# Altium schematic sheet TheremineB.SchDoc
size A4
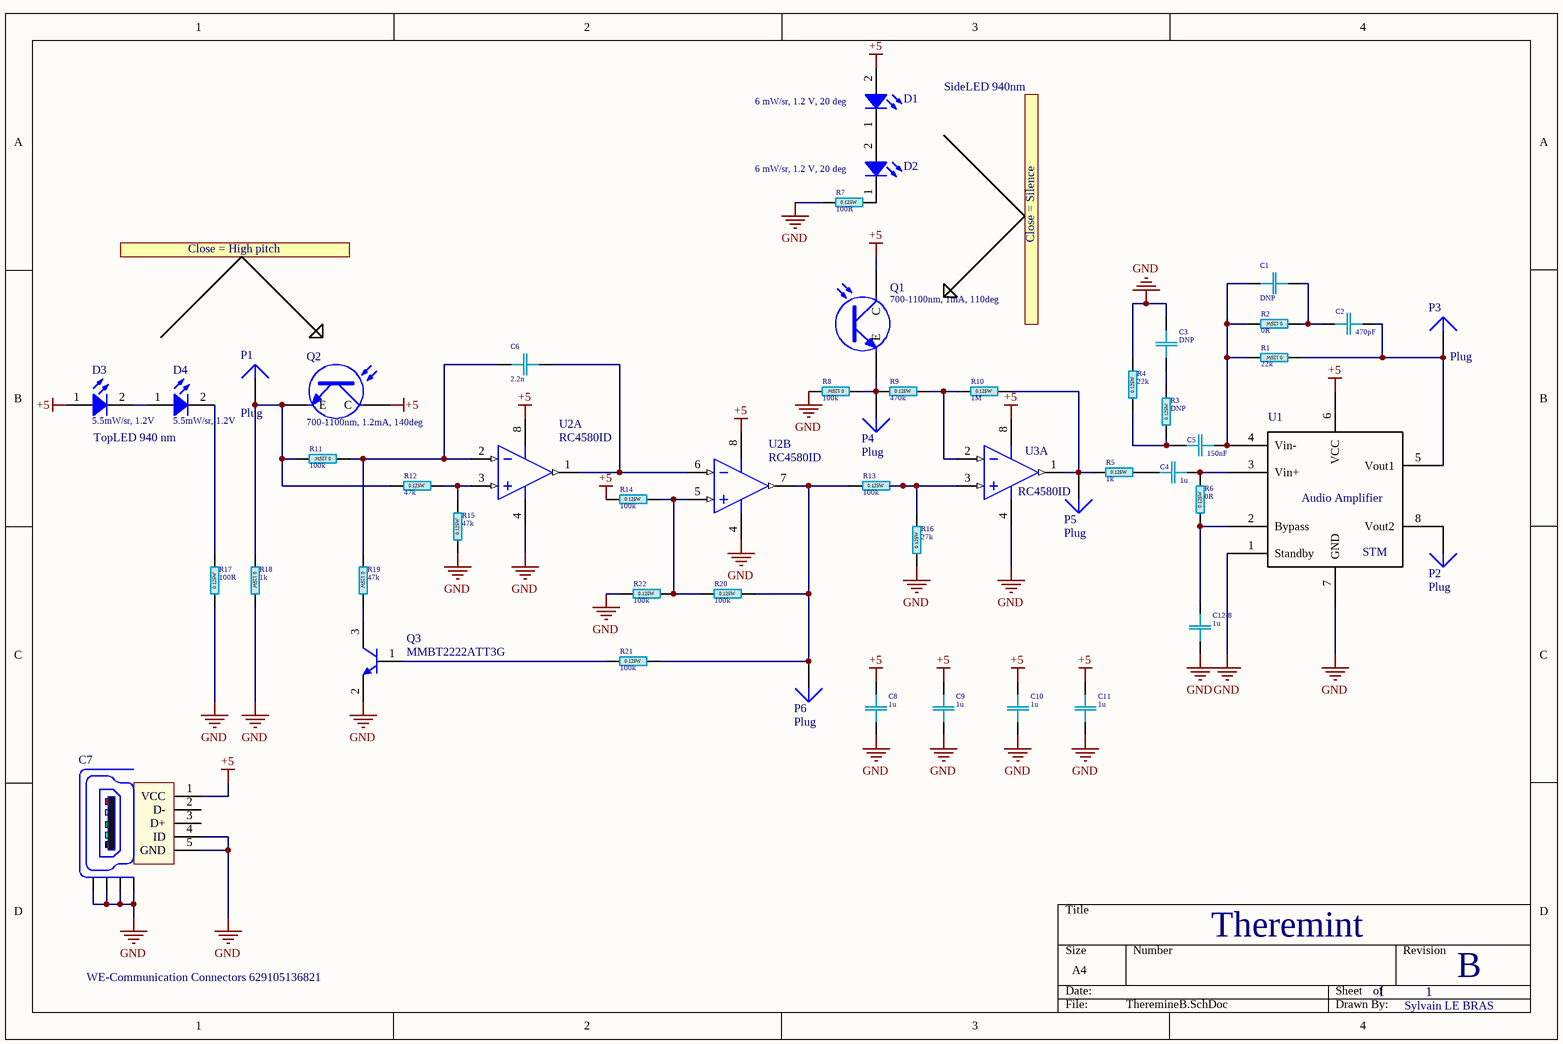
[diagram p0: TheremineB.SchDoc]

## Parts
C1  DNP  [C 0805(2012)x1.25]
C2  470pF  [C 0805(2012)x1.25]
C3  DNP  [C 0805(2012)x1.25]
C4  1u  [C 0805(2012)x1.25]
C5  150nF  [C 0805(2012)x1.25]
C6  2.2n  [C 0805(2012)x0.65]
C7  WE-Communication Connectors 629105136821  [629105136821]
C8  1u  [C 0805(2012)x1.25]
C9  1u  [C 0805(2012)x1.25]
C10  1u  [C 0805(2012)x1.25]
C11  1u  [C 0805(2012)x1.25]
C12-8  1u  [C 0805(2012)x1.25]
D1  6 mW/sr, 1.2 V, 20 deg  [WL-SISW_1206]
D2  6 mW/sr, 1.2 V, 20 deg  [WL-SISW_1206]
D3  5.5mW/sr, 1.2V  [WL-SICW_1206_H=1.21mm]
D4  5.5mW/sr, 1.2V  [WL-SICW_1206_H=1.21mm]
P1  Plug  [PIN1]
P2  Plug  [PIN1]
P3  Plug  [PIN1]
P4  Plug  [PIN1]
P5  Plug  [PIN1]
P6  Plug  [PIN1]
Q1  700-1100nm, 1mA, 110deg  [WL-STSB_1002]
Q2  700-1100nm, 1.2mA, 140deg  [WL-STCB_1206]
Q3  MMBT2222ATT3G  [ON SEMICONDUCTOR SC-75]
R1  22k  [R 0805(2012)]
R2  0R  [R 0805(2012)]
R3  DNP  [R 0805(2012)]
R4  22k  [R 0805(2012)]
R5  1k  [R 0805(2012)]
R6  0R  [R 0805(2012)]
R7  100R  [R 0805(2012)]
R8  100k  [R 0805(2012)]
R9  470k  [R 0805(2012)]
R10  1M  [R 0805(2012)]
R11  100k  [R 0805(2012)]
R12  47k  [R 0805(2012)]
R13  100k  [R 0805(2012)]
R14  100k  [R 0805(2012)]
R15  47k  [R 0805(2012)]
R16  27k  [R 0805(2012)]
R17  100R  [R 0805(2012)]
R18  1k  [R 0805(2012)]
R19  47k  [R 0805(2012)]
R20  100k  [R 0805(2012)]
R21  100k  [R 0805(2012)]
R22  100k  [R 0805(2012)]
U1  STM  [SO8_M]
U2  RC4580ID  [TI-D8_N]  (parts A,B of 2)
U3  RC4580ID  [TI-D8_N]  (part A of 2)

## Nets
+5: C7.1(VCC) C8.2 C9.2 C10.2 C11.2 D1.2(A) D3.1(A) Q1.1(C) Q2.1(C) R14.1 U1.6(VCC) U2.8(VCC+) U3.8(VCC+)
GND: C3.2 C7.4(ID) C7.5(GND) C7.Z1(Shield) C7.Z2(Shield) C7.Z3(Shield) C7.Z4(Shield) C8.1 C9.1 C10.1 C11.1 C12-8.2 Q3.2(E) R4.2 R7.1 R8.2 R15.1 R16.1 R17.1 R18.2 R22.1 U1.1(Standby) U1.7(GND) U2.4(VCC-) U3.4(VCC-)
NetC1_1: C1.1 C5.2 R1.2 R2.2 U1.4(Vin-)
NetC1_2: C1.2 C2.1 R2.1
NetC2_2: C2.2 P3.1 R1.1 U1.5(Vout1)
NetC3_1: C3.1 R3.2
NetC4_1: C4.1 R5.2
NetC4_2: C4.2 R6.2 U1.3(Vin+)
NetC5_1: C5.1 R3.1 R4.1
NetC6_1: C6.1 R11.1 R19.1 U2.2(IN1-)
NetC6_2: C6.2 U2.1(OUT1) U2.6(IN2-)
NetC12-8_1: C12-8.1 R6.1 U1.2(Bypass)
NetD1_1: D1.1(K) D2.2(A)
NetD2_1: D2.1(K) R7.2
NetD3_2: D3.2(K) D4.1(A)
NetD4_2: D4.2(K) R17.2
NetP1_1: P1.1 Q2.2(E) R11.2 R12.1 R18.1
NetP2_1: P2.1 U1.8(Vout2)
NetP4_1: P4.1 Q1.2(E) R8.1 R9.1
NetP5_1: P5.1 R5.1 R10.2 U3.1(OUT1)
NetP6_1: P6.1 R13.1 R20.2 R21.2 U2.7(OUT2)
NetQ3_1: Q3.1(B) R21.1
NetQ3_3: Q3.3(C) R19.2
NetR9_2: R9.2 R10.1 U3.2(IN1-)
NetR12_2: R12.2 R15.2 U2.3(IN1+)
NetR13_2: R13.2 R16.2 U3.3(IN1+)
NetR14_2: R14.2 R20.1 R22.2 U2.5(IN2+)

Not connected (* = marked no-connect by the designer): C7 2(D-) 3(D+)

## Notes on the sheet
- SideLED 940nm
- Close = High pitch
- Close = Silence
- TopLED 940 nm
- Theremint
- 1
- B
- Sylvain LE BRAS

## Library data of the parts
C1-C5 C8-C11 C12-8 = C 0805    16V X7R - 1u: SMD 0805     16V X7R 10%; Part Number: CL21B105KBFNNNF; Manufacturer: Samsung; TYPE: Capacitors; Package-mm: 2012; Mount Type: SMT; Publisher: Hefest; Manufacturer Alternate: *; Part Number Alternate: *; Supplier 1: Comet; Supplier Part Number 1: C0805 1.0uF 50V X7R SAMSUNG; RoHS: Y; Technology: Ceramic  MLCC; Package: 0805; VDC: 16V; TempCo: X7R; Tolerance %: ±10%; VAC: *; ESR Ohm: *; ComponentLink1Description: Datasheet Link; ComponentLink1URL: https://store.comet.bg/download-file.php?id=11; Temperature Range: -55°C ~ +125°C; Price: 0.120; Published: 07.04.2019
  C1 C3: Value: DNP
  C2: Value: 470pF
  C4 C8-C11 C12-8: Value: 1u
  C5: Value: 150nF
C6 = C 0805    50V X7R - 2.2n: SMD 0805     50V X7R 10%; Part Number: CL21B222KBNC; Manufacturer: Samsung; TYPE: Capacitors; Package-mm: 2012; Mount Type: SMT; Publisher: Hefest; Manufacturer Alternate: *; Part Number Alternate: *; Published: 07.04.2019; Supplier 1: Comet; Supplier Part Number 1: C0805 2.2nF 50V X7R SAMSUNG; RoHS: Y; Technology: Ceramic  MLCC; Package: 0805; VDC: 50V; TempCo: X7R; Tolerance %: ±10%; VAC: *; ESR Ohm: *; ComponentLink1Description: Datasheet Link; ComponentLink1URL: https://store.comet.bg/download-file.php?id=11; Temperature Range: -55°C ~ +125°C; Price: 0.026; Value: 2.2n
C7 = WE-Communication Connectors 629105136821: WR-COM Micro USB SMT Type B; Manufacturer: Würth Elektronik eiSos GmbH; ComponentLink1 Description: Manufacturer; ComponentLink2 Description: Datasheet; NoPins: 5; ComponentLink1URL: http://www.we-online.de; ComponentLink2URL: http://katalog.we-online.de/em/datasheet/629105136821.pdf; Created by: Karrer Zheng; Created Date: 10/10/2014; partNo: 629105136821
D1 D2 = 15412094A2070: SMT Infrared Sideview LED Waterclear WL-SISW, size 1206, 6 mW/sr, 1.2 V, 20 deg; Forward Voltage: 1.2 V; Viewing Angle: 20 deg; Peak Wavelength: 940 nm; Radiant Intensity: 6 mW/sr; Chip Technology: AlGaAs; ComponentLink1Description: Manufacturer; ComponentLink1URL: http://www.we-online.de; ComponentLink2Description: Datasheet; ComponentLink2URL: https://katalog.we-online.de/led/datasheet/15412094A2070.pdf; Part Number: 15412094A2070; Published Date: November 2018; Publisher: Wurth Elektronik; Size: 1206; Operating Temperature: -40 to 85 degC; Centroid Wavelength: 940 nm; Emitting Color: Infrared; Mounting Technology: SMT; Packaging: Tape and Reel
D3 D4 = 15412094A9000: WL-SICW SMT Chip LED Infrared Waterclear, size 1206, 5.5mW/sr, 1.2V, 90deg; Chip Technology: AlGaAs; Forward Voltage max.: 1.5V; Centroid Wavelength typ.: 940nm; Radiant Intensity min.: 4mW/sr; Radiant Intensity typ.: 5.5mW/sr; ComponentLink1Description: Manufacturer; ComponentLink1URL: http://www.we-online.de; ComponentLink2URL: https://www.we-online.com/catalog/datasheet/15412094A9000.pdf; ComponentLink2Description: Datasheet; Emitting Color: Infrared; Forward Voltage typ.: 1.2V; Mounting Technology: SMT; Operating Temperature: -40 to +85degC; Published Date: December 2019; Part Number: 15412094A9000; Packaging: Tape and Reel; Peak Wavelength typ.: 940nm; Publisher: Wurth Elektronik; Viewing Angle: 90deg; Size: 1206
Q1 = 1541021NCA170: WL-STSB SMT Phototransistor Chip Black, size 1002, 700-1100nm, 1mA, 110deg; Collector-Emitter Dark Current max.: 100nA; Chip Technology: Si; Range of Spectral Bandwidth max.: 1100nm; Range of Spectral Bandwidth min.: 700nm; Wavelength of Peak Sensitivity typ.: 940nm; Collector Current min.: 0.5mA; ComponentLink1Description: Manufacturer; ComponentLink1URL: http://www.we-online.de; ComponentLink2Description: Datasheet; ComponentLink2URL: https://www.we-online.com/catalog/datasheet/1541021NCA170.pdf; Packaging: Tape and Reel; Published Date: March 2020; Publisher: Wurth Elektronik; Size: 1002; Mounting Technology: SMT; Manufacturer Part Number: 1541021NCA170; Operating Temperature: -40 to +85degC; Viewing Angle: 110deg; Collector Current typ.: 1mA
Q2 = 1541201NEA400: WL-STCB SMT Phototransistor Chip Black, size 1206, 700-1100nm, 1.2mA, 140deg; Collector-Emitter Dark Current max.: 100nA; Chip Technology: Si; Range of Spectral Bandwidth max.: 1100nm; Range of Spectral Bandwidth min.: 700nm; Wavelength of Peak Sensitivity typ.: 940nm; Collector Current min.: 0.1mA; ComponentLink1Description: Manufacturer; ComponentLink1URL: http://www.we-online.de; ComponentLink2Description: Datasheet; ComponentLink2URL: https://www.we-online.com/catalog/datasheet/1541201NEA400.pdf; Packaging: Tape and Reel; Published Date: March 2020; Publisher: Wurth Elektronik; Size: 1206; Mounting Technology: SMT; Manufacturer Part Number: 1541201NEA400; Operating Temperature: -40 to +85degC; Viewing Angle: 140deg; Collector Current typ.: 1.2mA
Q3 = MMBT2222ATT3G: TRANS NPN 40V 0.6A SC75-3; Manufacturer: ON Semiconductor; Current - Collector Cutoff (Max): 10nA (ICBO); Current - Collector (Ic) (Max): 600mA; DC Current Gain (hFE) (Min) @ Ic, Vce: 100 @ 150mA, 10V; Frequency - Transition: 300MHz; Power - Max: 150mW; Vce Saturation (Max) @ Ib, Ic: 1V @ 50mA, 500mA; Part Number: MMBT2222ATT3G; ComponentLink1Description: Datasheet; ComponentLink1URL: //media.digikey.com/pdf/Data%20Sheets/ON%20Semiconductor%20PDFs/MMBT2222LT1-D.pdf; ComponentLink2Description: DigiKey Link; ComponentLink2URL: http://digikey.com/product-detail/en/on-semiconductor/MMBT2222ATT3G/MMBT2222ATT3GOSCT-ND/9086854; LastUpdated: 13/08/2020 11:04:21; Lifecycle Status: Active; Minimum Order: 1; Mounting Type: Surface Mount; Operating Temperature: -55°C ~ 150°C (TJ); Package / Case: SC-75, SOT-416; Packaging: TapeAndReel; PartId: 35; Part Status: Active; Price: 0.03; Series: -; Supplier 1: DigiKey; Supplier Part Number 1: MMBT2222ATT3GOSCT-ND; Supplier Device Package: SC-75, SOT-416; Transistor Type: NPN; Voltage - Collector Emitter Breakdown (Max): 40V
R1-R22 = R 0805-5%: SMD 0805 0.125W 5% 150V; Manufacturer: YAGEO; TempCo: ±100ppm/°C; Package-mm: 2012; Value Code: 102; Part Number: *; Mount Type: SMT; Publisher: Hefest; Manufacturer Alternate: *; Published: 07.04.2019; Supplier 1: Comet; Supplier Part Number 1: R0805 1.0K 5% YAG; RoHS: Y; Technology: Thick film; Package: 0805; VDC: 150V; Tolerance %: ±5%; ComponentLink1Description: Datasheet Link; ComponentLink1URL: https://store.comet.bg/download-file.php?id=140; Temperature Range: -55°C ~ +155°C; Price: 0.029; Part Number Alternate: *; TYPE: Resistor; Power: 0.125W
  R1 R4: Value: 22k
  R2 R6: Value: 0R
  R3: Value: DNP
  R5 R18: Value: 1k
  R7 R17: Value: 100R
  R8 R11 R13 R14 R20-R22: Value: 100k
  R9: Value: 470k
  R10: Value: 1M
  R12 R15 R19: Value: 47k
  R16: Value: 27k
U1 = TS4871: Audio Amplifier
U2 U3 = RC4580ID: Dual Audio Operational Amplifier, 4 to 32 V, -40 to 85 degC, 8-pin SOIC (D8), Green (RoHS & no Sb/Br); Manufacturer: Texas Instruments; CMRR(Min)(dB): 80; GBW(Typ)(MHz): 12; IIB(Max)(pA): 500000; Iq per channel(Max)(mA): 4.5; Number of Channels: 2; Slew Rate(Typ)(V/us): 5; Sub Family: General Purpose Amplifier, High Supply Voltage Amplifier (>=30V), Low Noise Amp (<=10nV/rtHz); Total Supply Voltage(Max)(+5V is 5, +/-5V is 10): 32; Total Supply Voltage(Min)(+5V is 5, +/-5V is 10): 4; Vio (25C)(Max)(mV): 3; Vn at 1kHz(Typ)(nV/rtHz): 6.2; DatasheetVersion: SLOS412C; PackageVersion: 4040047-3/M, 06/2011; PackageReference: D8; PackageDescription: 8-Pin Plastic Small Outline, Body 4.9 x 3.9 mm, Pitch 1.27 mm; Supplier 1: Digi-Key; Supplier Part Number 1: 296-26318-5-ND; Supplier 2: Newark; Supplier Part Number 2: 61H5379; Supplier 3: Mouser; Supplier Part Number 3: 595-RC4580ID; Eco-Plan: Green (RoHS & no Sb/Br); Mounting Technology: Surface Mount; Code_JEDEC: MS-012; PartNumber: RC4580ID; ComponentLink1Description: Manufacturer URL; ComponentLink1URL: http://www.ti.com/; ComponentLink2Description: Datasheet; ComponentLink2URL: http://www.ti.com/lit/ds/symlink/rc4580.pdf; ComponentLink3Description: Package Specification; ComponentLink3URL: http://www.ti.com/litv/pdf/msoi002j
P1-P6 = Plug: LatestRevisionDate: 17-Jul-2002; LatestRevisionNote: Re-released for DXP Platform.; Publisher: Altium Limited